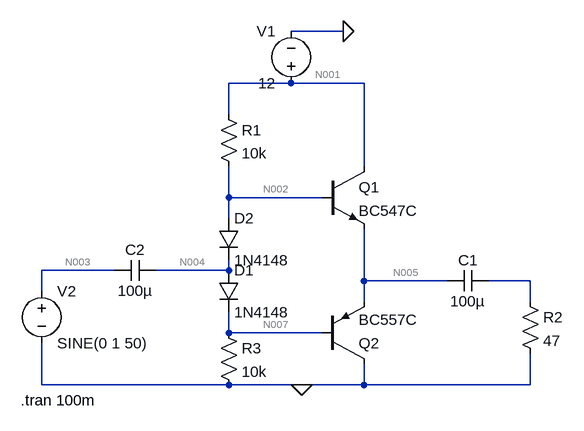
[diagram p0: schematic project2.asc]
project2.asc, the LTspice schematic file:
Version 4.1
SHEET 1 880 680
WIRE 256 -112 176 -112
WIRE 176 -32 80 -32
WIRE 288 -32 176 -32
WIRE 80 16 80 -32
WIRE 288 96 288 -32
WIRE 80 144 80 96
WIRE 224 144 80 144
WIRE 80 176 80 144
WIRE -96 256 -208 256
WIRE 80 256 80 240
WIRE 80 256 -32 256
WIRE 288 272 288 192
WIRE 416 272 288 272
WIRE 544 272 480 272
WIRE -208 288 -208 256
WIRE 288 304 288 272
WIRE 544 304 544 272
WIRE 80 352 80 320
WIRE 224 352 80 352
WIRE -208 432 -208 368
WIRE 80 432 -208 432
WIRE 192 432 80 432
WIRE 288 432 288 400
WIRE 288 432 192 432
WIRE 544 432 544 384
WIRE 544 432 288 432
FLAG 192 432 0
FLAG 256 -112 0
SYMBOL npn 224 96 R0
SYMATTR InstName Q1
SYMATTR Value BC547C
SYMBOL res 64 0 R0
SYMATTR InstName R1
SYMATTR Value 10k
SYMBOL diode 64 176 R0
SYMATTR InstName D2
SYMATTR Value 1N4148
SYMBOL cap 480 256 R90
WINDOW 0 0 32 VBottom 2
WINDOW 3 32 32 VTop 2
SYMATTR InstName C1
SYMATTR Value 100µ
SYMBOL res 528 288 R0
SYMATTR InstName R2
SYMATTR Value 47
SYMBOL res 64 336 R0
SYMATTR InstName R3
SYMATTR Value 10k
SYMBOL voltage -208 272 R0
WINDOW 123 0 0 Left 0
WINDOW 39 0 0 Left 0
SYMATTR InstName V2
SYMATTR Value SINE(0 1 50)
SYMBOL voltage 176 -16 R180
WINDOW 0 24 96 Left 2
WINDOW 3 24 16 Left 2
WINDOW 123 0 0 Left 0
WINDOW 39 0 0 Left 0
SYMATTR InstName V1
SYMATTR Value 12
SYMBOL diode 64 256 R0
SYMATTR InstName D1
SYMATTR Value 1N4148
SYMBOL cap -32 240 R90
WINDOW 0 0 32 VBottom 2
WINDOW 3 32 32 VTop 2
SYMATTR InstName C2
SYMATTR Value 100µ
SYMBOL pnp 224 400 M180
SYMATTR InstName Q2
SYMATTR Value BC557C
TEXT -240 456 Left 2 !.tran 100m

The netlist it stands for:
* project2.asc
Q1 N001 N002 N005 0 BC547C
R1 N001 N002 10k
D2 N002 N004 1N4148
C1 N006 N005 100µ
R2 N006 0 47
R3 N007 0 10k
V2 N003 0 SINE(0 1 50)
V1 N001 0 12
D1 N004 N007 1N4148
C2 N004 N003 100µ
Q2 0 N007 N005 0 BC557C
.model D D
.lib standard.dio
.model NPN NPN
.model PNP PNP
.lib standard.bjt
.tran 100m
.backanno
.end

* Results of the author's LTspice run, read from the files saved beside the schematic
* Operating Point, zero values left out:
*   V(n002) = 6.557 V
*   V(n004) = 6 V
*   V(n001) = 12 V
*   V(n005) = 5.997 V
*   V(n007) = 5.443 V
*   Ic(Q1) = 106.3 µA
*   Ib(Q1) = 212.8 nA
*   Ie(Q1) = -106.5 µA
*   I(R3) = 544.3 µA
*   I(V1) = -650.6 µA
*   Ic(Q2) = -106.3 µA
*   Ib(Q2) = -198.3 nA
*   Ie(Q2) = 106.5 µA
*   I(D2) = 544.1 µA
*   I(R1) = 544.3 µA
*   I(D1) = 544.1 µA
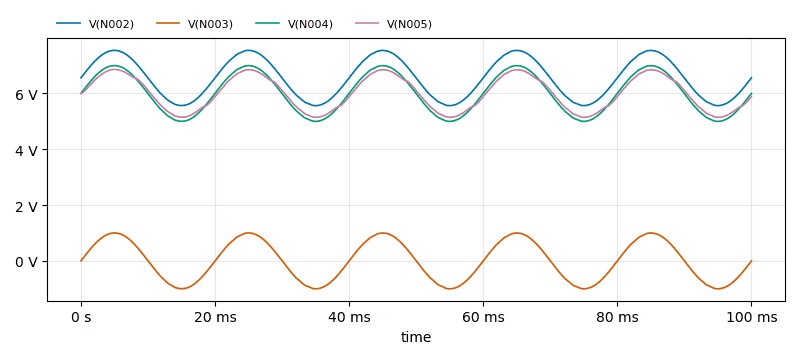
[diagram p1: Transient Analysis of project2.asc, plotted from the saved traces]
* Transient Analysis, 1 run:
*   V(N002): min 5.559 V, max 7.538 V, average 6.55 V, rms 6.587 V, last 6.557 V
*   V(N003): min -1 V, max 1 V, average 227.7 µV, rms 705.5 mV, last 0 V
*   V(N004): min 4.995 V, max 6.994 V, average 5.994 V, rms 6.036 V, last 6.002 V
*   V(N005): min 5.141 V, max 6.855 V, average 5.996 V, rms 6.025 V, last 5.886 V